# Altium project Placa_Control.PrjPCB
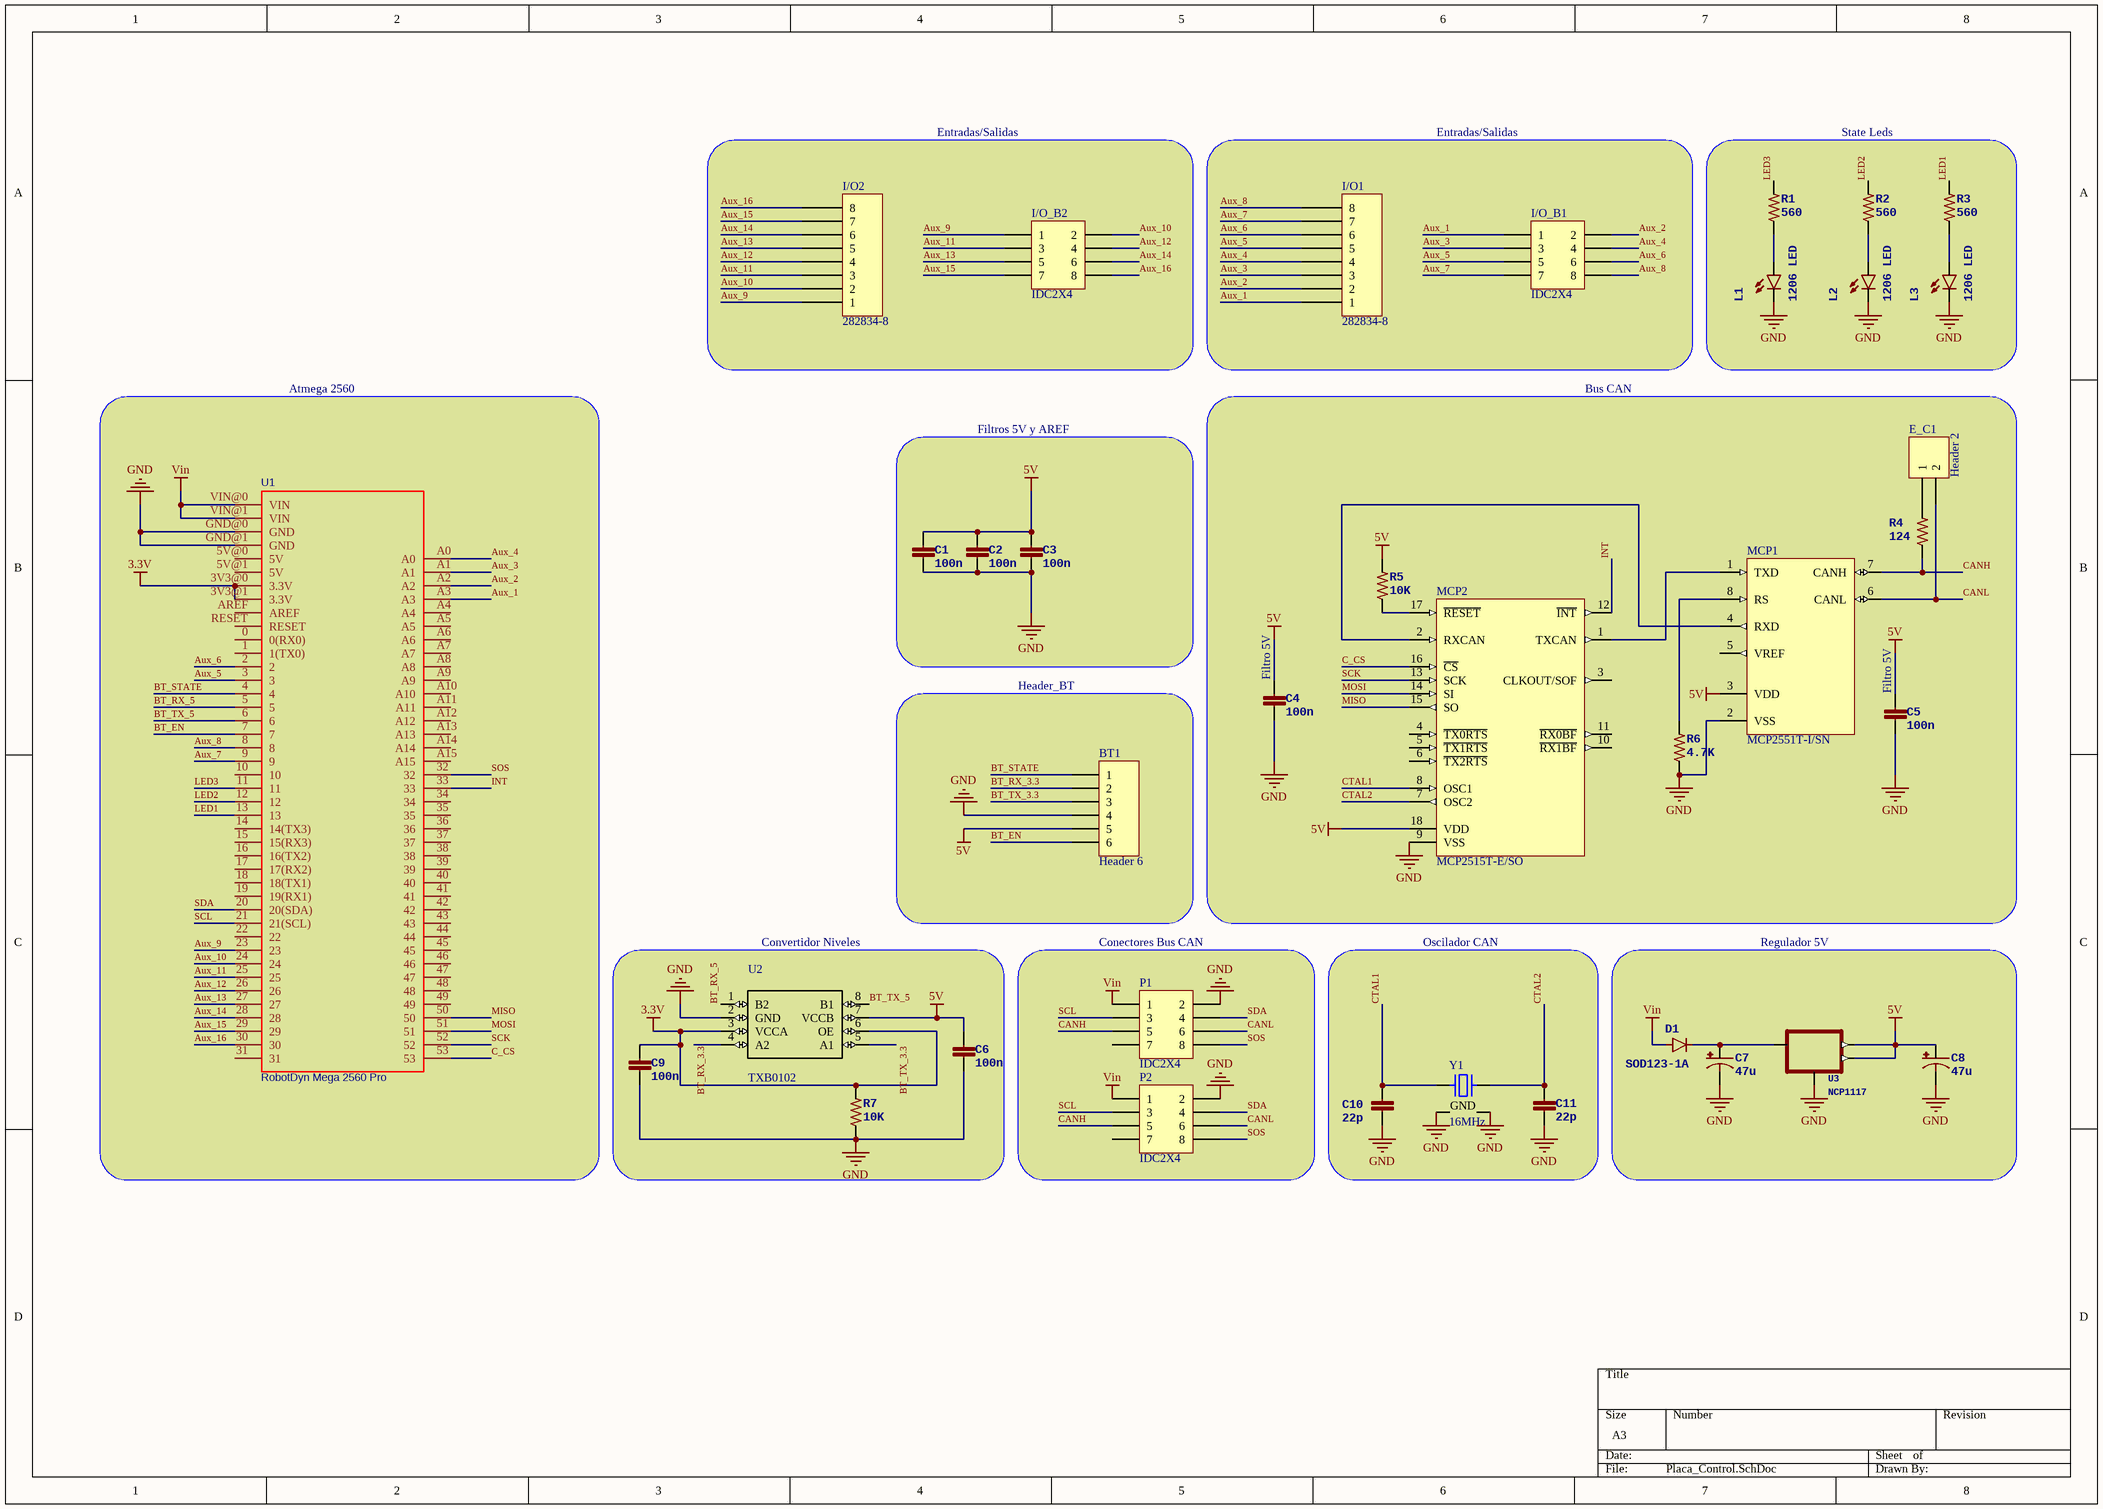
[diagram p0: Placa_Control.SchDoc]
1 sheet, 36 parts. Net scope: global (net labels, ports and power ports of the same name join across sheets).
Board file: Placa_Control.PcbDoc

## Sheet Placa_Control.SchDoc
size A3

### Parts
BT1  Header 6  [HDR1X6]
C1  100n  [0805]
C2  100n  [0805]
C3  100n  [0805]
C4  100n  [0805]
C5  100n  [0805]
C6  100n  [0805]
C7  47u  [PANASONIC_D]
C8  47u  [PANASONIC_D]
C9  100n  [0805]
C10  22p  [0805]
C11  22p  [0805]
D1  SOD123-1A  [SOD-123]
E_C1  Header 2  [HDR1X2]
I/O1  282834-8  [TE 282834-8]
I/O2  282834-8  [TE 282834-8]
I/O_B1  IDC2X4  [IDC2X4]
I/O_B2  IDC2X4  [IDC2X4]
L1  1206 LED  [LED-1206]
L2  1206 LED  [LED-1206]
L3  1206 LED  [LED-1206]
MCP1  MCP2551T-I/SN  [SOIC-SN8_N]
MCP2  MCP2515T-E/SO  [SOIC-SO18_N]
P1  IDC2X4  [IDC2X4]
P2  IDC2X4  [IDC2X4]
R1  560  [0805]
R2  560  [0805]
R3  560  [0805]
R4  124  [0805]
R5  10K  [0805]
R6  4.7K  [0805]
R7  10K  [0805]
U1  RobotDyn Mega 2560 Pro  [Mega2560Pro_Layout]
U2  TXB0102  [SOP50P310X90-8N]
U3  NCP1117  [SOT223]
Y1  16MHz  [NDK NX3225SA]

### Blocks framed on the sheet
Entradas/Salidas: I/O2 I/O_B2
Entradas/Salidas: I/O1 I/O_B1
State Leds: L1-L3 R1-R3
Atmega 2560: U1
Filtros 5V y AREF: C1-C3
Header_BT: BT1
Convertidor Niveles: C6 C9 R7 U2
Conectores Bus CAN: P1 P2
Oscilador CAN: C10 C11 Y1
Regulador 5V: C7 C8 D1 U3

### Nets
3.3V: C9.1 R7.2 U1.3V3@0(3.3V) U1.3V3@1(3.3V) U2.3(VCCA) U2.6(OE)
5V: BT1.5 C1.1 C2.1 C3.1 C4.1 C5.1 C6.1 C8.+ MCP1.3(VDD) MCP2.18(VDD) R5.2 U2.7(VCCB) U3.2(OUT) U3.4(OUT@1)
GND: BT1.4 C1.2 C2.2 C3.2 C4.2 C5.2 C6.2 C7.- C8.- C9.2 C10.2 C11.2 L1.C L2.C L3.C MCP1.2(VSS) MCP2.9(VSS) P1.2 P2.2 R6.1 R7.1 U1.GND@0(GND) U1.GND@1(GND) U2.2(GND) U3.1(ADJ) Y1.2(GND) Y1.4(GND)
Vin: D1.A P1.1 P2.1 U1.VIN@0(VIN) U1.VIN@1(VIN)
Aux_1: I/O1.1 I/O_B1.1 U1.A3
Aux_2: I/O1.2 I/O_B1.2 U1.A2
Aux_3: I/O1.3 I/O_B1.3 U1.A1
Aux_4: I/O1.4 I/O_B1.4 U1.A0
Aux_5: I/O1.5 I/O_B1.5 U1.3
Aux_6: I/O1.6 I/O_B1.6 U1.2
Aux_7: I/O1.7 I/O_B1.7 U1.9
Aux_8: I/O1.8 I/O_B1.8 U1.8
Aux_9: I/O2.1 I/O_B2.1 U1.23
Aux_10: I/O2.2 I/O_B2.2 U1.24
Aux_11: I/O2.3 I/O_B2.3 U1.25
Aux_12: I/O2.4 I/O_B2.4 U1.26
Aux_13: I/O2.5 I/O_B2.5 U1.27
Aux_14: I/O2.6 I/O_B2.6 U1.28
Aux_15: I/O2.7 I/O_B2.7 U1.29
Aux_16: I/O2.8 I/O_B2.8 U1.30
BT_EN: BT1.6 U1.7
BT_RX_3.3: BT1.2 U2.4(A2)
BT_RX_5: U1.5 U2.1(B2)
BT_STATE: BT1.1 U1.4
BT_TX_3.3: BT1.3 U2.5(A1)
BT_TX_5: U1.6 U2.8(B1)
C_CS: MCP2.16(~{CS}) U1.53
CANH: MCP1.7(CANH) P1.5 P2.5 R4.1
CANL: E_C1.2 MCP1.6(CANL) P1.6 P2.6
CTAL1: C10.1 MCP2.8(OSC1) Y1.1
CTAL2: C11.1 MCP2.7(OSC2) Y1.3
INT: MCP2.12(~{INT}) U1.33
LED1: R3.2 U1.13
LED2: R2.2 U1.12
LED3: R1.2 U1.11
MISO: MCP2.15(SO) U1.50
MOSI: MCP2.14(SI) U1.51
SCK: MCP2.13(SCK) U1.52
SCL: P1.3 P2.3 U1.21(21(SCL))
SDA: P1.4 P2.4 U1.20(20(SDA))
SOS: P1.8 P2.8 U1.32
NetC7_+: C7.+ D1.C U3.3(IN)
NetE_C1_1: E_C1.1 R4.2
NetL1_A: L1.A R1.1
NetL2_A: L2.A R2.1
NetL3_A: L3.A R3.1
NetMCP1_1: MCP1.1(TXD) MCP2.1(TXCAN)
NetMCP1_4: MCP1.4(RXD) MCP2.2(RXCAN)
NetMCP1_8: MCP1.8(RS) R6.2
NetMCP2_17: MCP2.17(~{RESET}) R5.1

Not connected (* = marked no-connect by the designer): MCP1 5(VREF); MCP2 3(CLKOUT/SOF) 4(~{TX0RTS}) 5(~{TX1RTS}) 6(~{TX2RTS}) 10(~{RX1BF}) 11(~{RX0BF}); P1 7; P2 7; U1 0(0(RX0)) 1(1(TX0)) 5V@0(5V) 5V@1(5V) 10 14(14(TX3)) 15(15(RX3)) 16(16(TX2)) 17(17(RX2)) 18(18(TX1)) 19(19(RX1)) 22 31 34 35 36 37 38 39 40 41 42 43 44 45 46 47 48 49 A4 A5 A6 A7 A8 A9 A10 A11 A12 A13 A14 A15 AREF RESET

### Notes on the sheet
- Bus CAN
- (near C4) Filtro 5V
- (near C5) Filtro 5V

### Library data of the parts
BT1 = Header 6: Header, 6-Pin; LatestRevisionDate: 17-Jul-2002; LatestRevisionNote: Re-released for DXP Platform.; Publisher: Altium Limited
C1-C6 C9-C11 = CAP0805
C7 C8 = 47UF-50V-20%(ELECT): PROD_ID: CAP-10547
D1 = DIODESOD123
E_C1 = Header 2: Header, 2-Pin; LatestRevisionDate: 17-Jul-2002; LatestRevisionNote: Re-released for DXP Platform.; Publisher: Altium Limited
I/O1 I/O2 = 282834-8: TERM BLOCK 8POS SIDE ENT 2.54MM; Manufacturer: TE Connectivity AMP Connectors; TemperatureRange: -40C ~ 105C; Voltage: 150V; Pitch: 0.100" (2.54mm); Number Of Levels: 1; Positions Per Level: 8; Part Number: 282834-8; PartId: 9295; Supplier 1: Digi-Key; Supplier Part Number 1: A98338-ND; ComponentLink1Description: Datasheet; ComponentLink1URL: http://www.te.com/commerce/DocumentDelivery/DDEController?Action=srchrtrv&DocNm=282834&DocType=Customer+Drawing&DocLang=English; ComponentLink2Description: Digi-Key Listing; ComponentLink2URL: http://www.digikey.ca/product-detail/en/282834-8/A98338-ND/1150136; Price: 8,41; Colour: Green; Orientation: Horizontal with Board
I/O_B1 I/O_B2 P1 P2 = IDC2X4: Header, 4-Pin, Dual row; LatestRevisionDate: 17-Jul-2002; LatestRevisionNote: Re-released for DXP Platform.; Publisher: Altium Limited
L1-L3 = LED1206
MCP1 = MCP2551T-I/SN: High-Speed CAN Transceiver, 8-Pin SOIC, Industrial Temperature, Tape and Reel; Published: 29-Jan-2009; DatasheetVersion: revE, Jan-2007; PackageVersion: revBB, Aug-2009; PackageReference: SOIC-SN8; Publisher: Altium Limited; PackageDescription: 8-Lead Plastic Small Outline (SN) - Narrow, 3.90mm Body [SOIC]; Supplier 1: Digi-Key; Supplier Part Number 1: MCP2551T-I/SNTR-ND; Supplier 2: Farnell; Supplier Part Number 2: 1788569; Code_JEDEC: MS-012; Code_IPC: SOIC127P600-8; ComponentLink1Description: Datasheet; ComponentLink1URL: http://ww1.microchip.com/downloads/en/DeviceDoc/21667E.pdf; ComponentLink2Description: Packaging Specification; ComponentLink2URL: http://www.microchip.com/stellent/groups/techpub_sg/documents/packagingspec/en012702.pdf; ComponentLink3Description: Microchip.com Home; ComponentLink3URL: http://www.microchip.com/
MCP2 = MCP2515T-E/SO: Stand-Alone CAN Controller With SPI Interface, 18-Pin SOIC, Extended Temperature, Tape and Reel; Published: 29-Jan-2009; DatasheetVersion: revE, Nov-2007; PackageVersion: revBB, Aug-2009; PackageReference: SOIC-SO18; Publisher: Altium Limited; PackageDescription: 18-Lead Plastic Small Outline (SO) - Wide 7.50mm Body [SOIC]; Supplier 1: Digi-Key; Supplier Part Number 1: MCP2515T-E/SO-ND; Code_JEDEC: MS-013; ComponentLink1Description: Datasheet; ComponentLink1URL: http://ww1.microchip.com/downloads/en/DeviceDoc/21801e.pdf; ComponentLink2Description: Packaging Specification; ComponentLink2URL: http://www.microchip.com/stellent/groups/techpub_sg/documents/packagingspec/en012702.pdf; ComponentLink3Description: Microchip.com Home; ComponentLink3URL: http://www.microchip.com/
R1-R7 = RESISTOR0805-RES
U2 = TXB0102: 2-Bit Bidirectional Voltage-Level Translator with Auto Direction Sensing and +/-15-kV ESD Protect; MF: Texas Instruments; SnapEDA_Link: https://www.snapeda.com/parts/TXB0102/Texas%20Instruments/view-part/?ref=snap; Price: None; MP: TXB0102; Availability: Unavailable; Package: None; Value: *
U3 = V_REG_LM1117SOT223: PROD_ID: VREG-08170
Y1 = NX3225SA-16.000MHZ-STD-CSR-1: CRYSTAL 16.0000MHZ 8PF SMD; Manufacturer: NDK; Frequency Stability: 15ppm; ESR: 80 Ohm; Operating Mode: Fundamental; Part Number: NX3225SA-16.000MHZ-STD-CSR-1; PartId: 8509; Supplier 1: Digi-Key; Supplier Part Number 1: 644-1049-2-ND; ComponentLink1Description: Datasheet; ComponentLink1URL: http://media.digikey.com/pdf/Data%20Sheets/NDK%20PDFs/NX3225SA.pdf; ComponentLink2Description: Digi-Key Listing; ComponentLink2URL: http://www.digikey.com/product-detail/en/NX3225SA-16.000MHZ-STD-CSR-1/644-1049-2-ND/1128831; Price: 0,3799; Type: MHz Crystal; Device Package: 4-SMD, No Lead (DFN, LCC); Frequency: 16MHz; Frequency Tolerance: 15ppm; Load Capacitance: 8pF
U1 = RobotDyn Mega 2560 Pro: BOM_Manufacturer Part: ?; spicePre: U